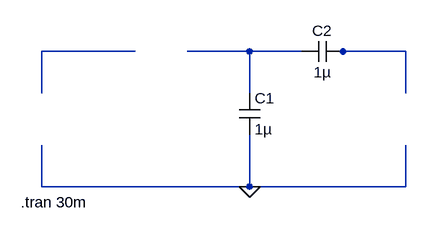
[diagram p0: schematic ex11.asc]
ex11.asc, the LTspice schematic file:
Version 4
SHEET 1 880 680
WIRE 224 96 80 96
WIRE 400 96 304 96
WIRE 480 96 400 96
WIRE 544 96 528 96
WIRE 640 96 544 96
WIRE 80 160 80 96
WIRE 400 160 400 96
WIRE 640 160 640 96
WIRE 80 304 80 240
WIRE 400 304 400 224
WIRE 400 304 80 304
WIRE 640 304 640 240
WIRE 640 304 400 304
FLAG 400 304 0
SYMBOL cap 384 160 R0
SYMATTR InstName C1
SYMATTR Value 1µ
SYMBOL cap 480 112 R270
WINDOW 0 32 32 VTop 2
WINDOW 3 0 32 VBottom 2
SYMATTR InstName C2
SYMATTR Value 1µ
TEXT 48 328 Left 2 !.tran 30m

The netlist it stands for:
* ex11.asc
C1 N002 0 1µ
C2 N002 N003 1µ
.tran 30m
.backanno
.end